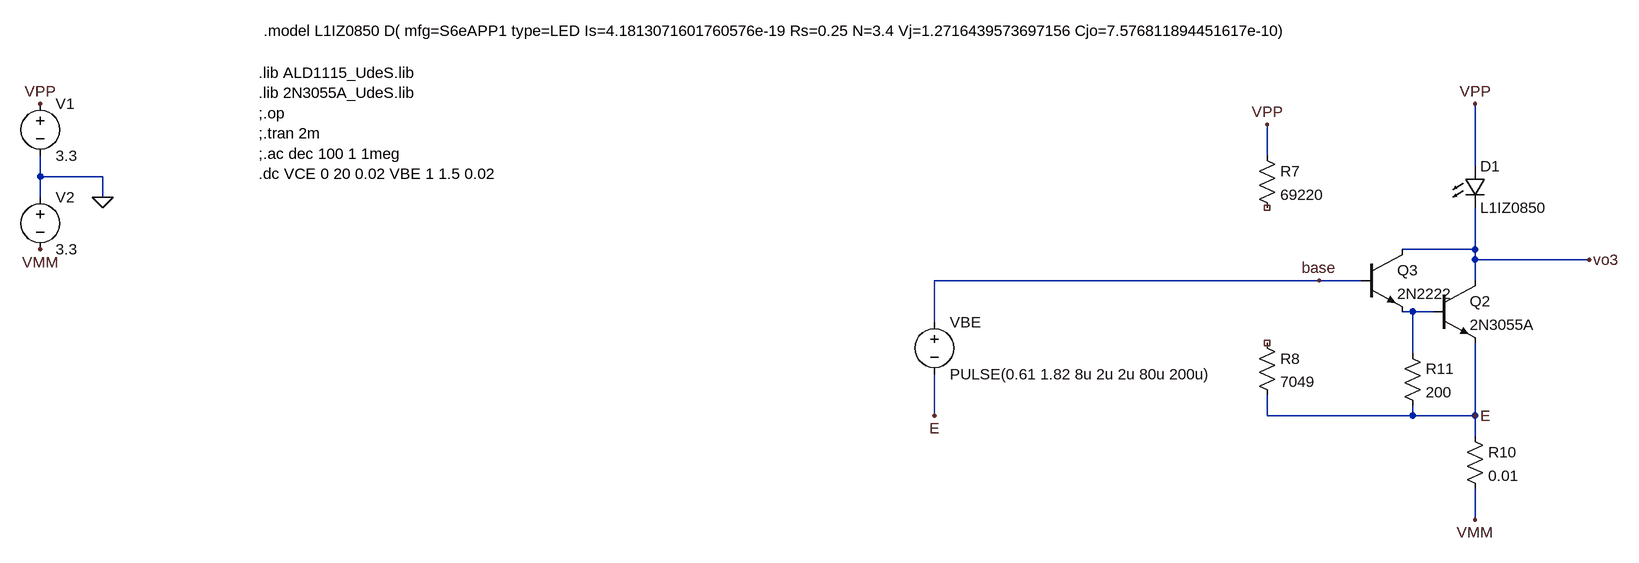
[diagram p0: schematic etage3.asc]
etage3.asc, the LTspice schematic file:
Version 4
SHEET 1 2260 1556
WIRE 912 32 912 -16
WIRE 1232 48 1232 -48
WIRE -976 64 -976 32
WIRE -880 64 -976 64
WIRE -976 96 -976 64
WIRE -880 96 -880 64
WIRE 1232 176 1232 112
WIRE 1232 176 1120 176
WIRE 1232 192 1232 176
WIRE 1408 192 1232 192
WIRE 992 224 400 224
WIRE 1056 224 992 224
WIRE 1232 224 1232 192
WIRE 1136 272 1120 272
WIRE 1168 272 1136 272
WIRE 400 288 400 224
WIRE 1136 336 1136 272
WIRE 400 432 400 368
WIRE 912 432 912 400
WIRE 1136 432 1136 416
WIRE 1136 432 912 432
WIRE 1232 432 1232 320
WIRE 1232 432 1136 432
WIRE 1232 464 1232 432
WIRE 1232 592 1232 544
FLAG -976 -48 VPP
FLAG -976 176 VMM
FLAG -880 96 0
FLAG 1232 -48 VPP
FLAG 1232 592 VMM
FLAG 1408 192 vo3
FLAG 1232 432 E
FLAG 912 -16 VPP
FLAG 992 224 base
FLAG 400 432 E
SYMBOL /voltage -976 -64 R0
WINDOW 123 0 0 Left 0
WINDOW 39 0 0 Left 0
SYMATTR InstName V1
SYMATTR Value 3.3
SYMBOL /voltage -976 80 R0
WINDOW 123 0 0 Left 0
WINDOW 39 0 0 Left 0
SYMATTR InstName V2
SYMATTR Value 3.3
SYMBOL /res 1216 448 R0
SYMATTR InstName R10
SYMATTR Value 0.01
SYMBOL LED 1216 48 R0
SYMATTR InstName D1
SYMATTR Value L1IZ0850
SYMBOL npn 1168 224 R0
SYMATTR InstName Q2
SYMATTR Value 2N3055A
SYMBOL /npn 1056 176 R0
SYMATTR InstName Q3
SYMATTR Value 2N2222
SYMBOL res 1120 320 R0
SYMATTR InstName R11
SYMATTR Value 200
SYMBOL res 896 16 R0
SYMATTR InstName R7
SYMATTR Value 69220
SYMBOL res 896 304 R0
SYMATTR InstName R8
SYMATTR Value 7049
SYMBOL /voltage 400 272 R0
WINDOW 123 0 0 Left 0
WINDOW 39 0 0 Left 0
SYMATTR InstName VBE
SYMATTR Value PULSE(0.61 1.82 8u 2u 2u 80u 200u)
TEXT -640 -96 Left 2 !.lib ALD1115_UdeS.lib\n.lib 2N3055A_UdeS.lib\n;.op\n;.tran 2m\n;.ac dec 100 1 1meg\n.dc VCE 0 20 0.02 VBE 1 1.5 0.02
TEXT -632 -160 Left 2 !.model L1IZ0850 D( mfg=S6eAPP1 type=LED Is=4.1813071601760576e-19 Rs=0.25 N=3.4 Vj=1.2716439573697156 Cjo=7.576811894451617e-10)

The netlist it stands for:
* etage3.asc
V1 VPP 0 3.3
V2 0 VMM 3.3
R10 E VMM 0.01
D1 VPP vo3 L1IZ0850
Q2 vo3 N001 E 0 2N3055A
Q3 vo3 base N001 0 2N2222
R11 N001 E 200
R7 VPP NC_01 69220
R8 NC_02 E 7049
VBE base E PULSE(0.61 1.82 8u 2u 2u 80u 200u)
.model D D
.lib standard.dio
.model NPN NPN
.model PNP PNP
.lib standard.bjt
.lib ALD1115_UdeS.lib
.lib 2N3055A_UdeS.lib
;.op
;.tran 2m
;.ac dec 100 1 1meg
.dc VCE 0 20 0.02 VBE 1 1.5 0.02
.model L1IZ0850 D( mfg=S6eAPP1 type=LED Is=4.1813071601760576e-19 Rs=0.25 N=3.4 Vj=1.2716439573697156 Cjo=7.576811894451617e-10)
.backanno
.end